# Altium schematic sheet dual-motor-driver.SchDoc
size A3
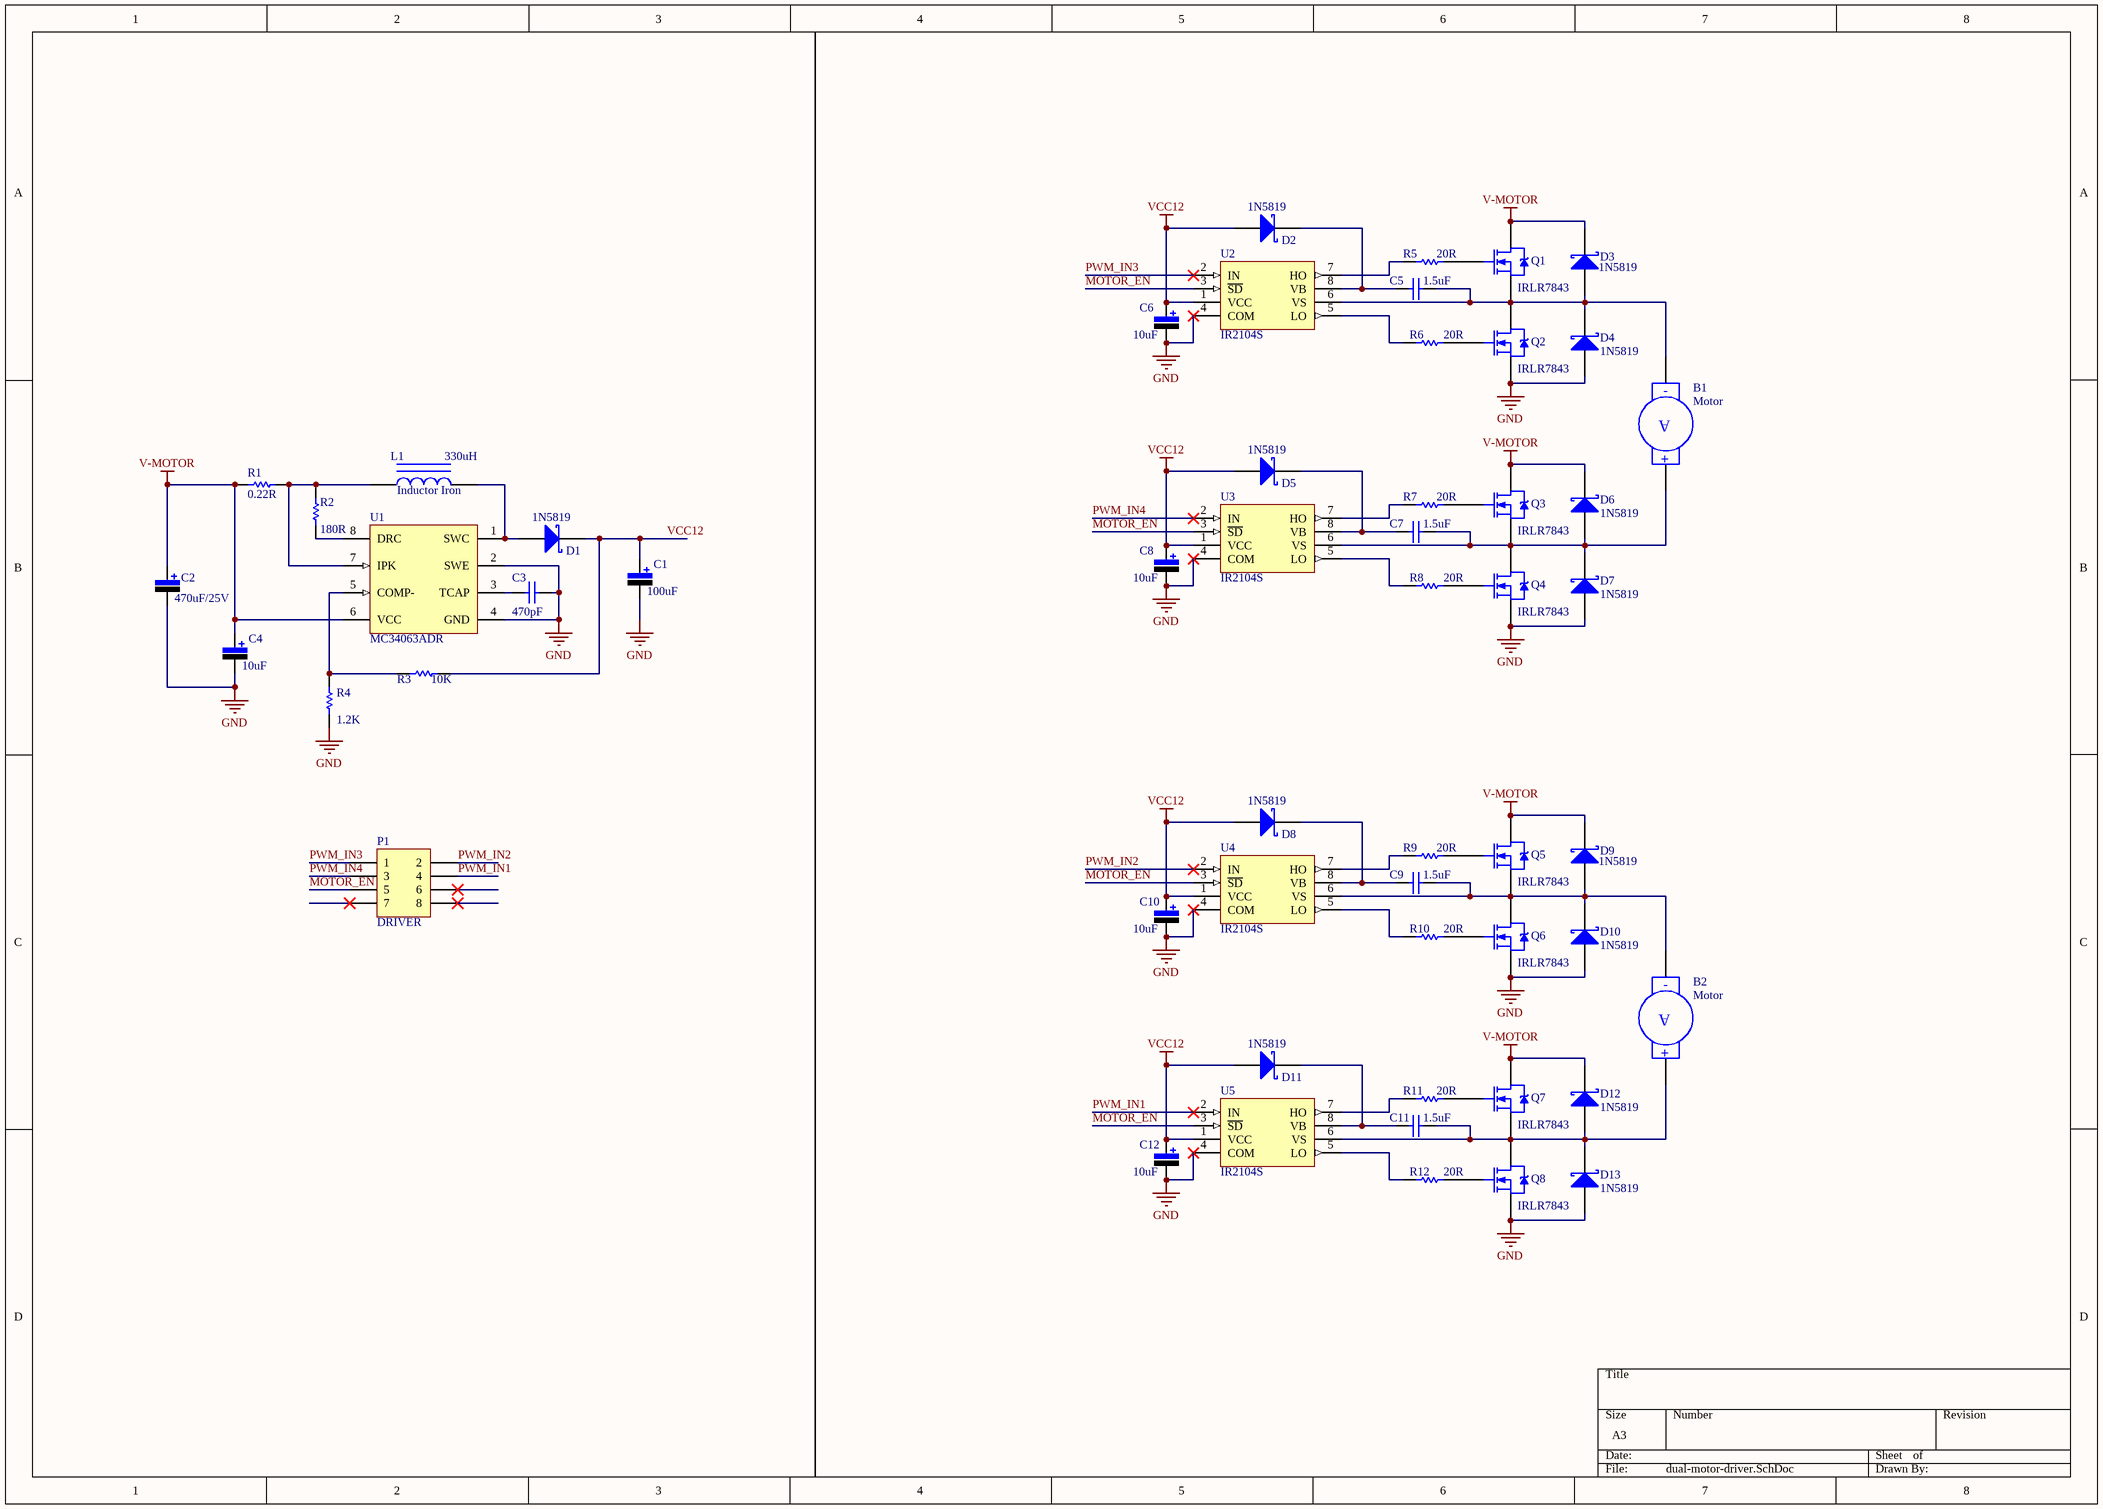
[diagram p0: dual-motor-driver.SchDoc]

## Parts
B1  Motor  [Con 2接线端子]
B2  Motor  [Con 2接线端子]
C1  value 100uF  [LC-CASE-D_7343]  (hidden comment: Cap-Pol)
C2  value 470uF/25V  [C-RB-3.5/8]  (hidden comment: Cap-Pol-ES)
C3  value 470pF  [LC-0603_C]  (hidden comment: Cap)
C4  value 10uF  [LC-CASE-C_6032]  (hidden comment: Cap-Pol)
C5  value 1.5uF  [LC-0805_C]  (hidden comment: Cap)
C6  value 10uF  [LC-CASE-C_6032]  (hidden comment: Cap-Pol)
C7  value 1.5uF  [LC-0805_C]  (hidden comment: Cap)
C8  value 10uF  [LC-CASE-C_6032]  (hidden comment: Cap-Pol)
C9  value 1.5uF  [LC-0805_C]  (hidden comment: Cap)
C10  value 10uF  [LC-CASE-C_6032]  (hidden comment: Cap-Pol)
C11  value 1.5uF  [LC-0805_C]  (hidden comment: Cap)
C12  value 10uF  [LC-CASE-C_6032]  (hidden comment: Cap-Pol)
D1  1N5819  [LC-SMA(DO-214AC)_S1]
D2  1N5819  [LC-SMA(DO-214AC)_S1]
D3  1N5819  [LC-SMA(DO-214AC)_S1]
D4  1N5819  [LC-SMA(DO-214AC)_S1]
D5  1N5819  [LC-SMA(DO-214AC)_S1]
D6  1N5819  [LC-SMA(DO-214AC)_S1]
D7  1N5819  [LC-SMA(DO-214AC)_S1]
D8  1N5819  [LC-SMA(DO-214AC)_S1]
D9  1N5819  [LC-SMA(DO-214AC)_S1]
D10  1N5819  [LC-SMA(DO-214AC)_S1]
D11  1N5819  [LC-SMA(DO-214AC)_S1]
D12  1N5819  [LC-SMA(DO-214AC)_S1]
D13  1N5819  [LC-SMA(DO-214AC)_S1]
L1  Inductor Iron  value 330uH  [L-SMD-12]
P1  DRIVER  [MHDR2X4]
Q1  IRLR7843  [TO-252AA_M]
Q2  IRLR7843  [TO-252AA_M]
Q3  IRLR7843  [TO-252AA_M]
Q4  IRLR7843  [TO-252AA_M]
Q5  IRLR7843  [TO-252AA_M]
Q6  IRLR7843  [TO-252AA_M]
Q7  IRLR7843  [TO-252AA_M]
Q8  IRLR7843  [TO-252AA_M]
R1  value 0.22R  [LC-0603_R]  (hidden comment: Res1)
R2  value 180R  [LC-0603_R]  (hidden comment: Res1)
R3  value 10K  [LC-0603_R]  (hidden comment: Res1)
R4  value 1.2K  [LC-0603_R]  (hidden comment: Res1)
R5  value 20R  [LC-0603_R]  (hidden comment: Res1)
R6  value 20R  [LC-0603_R]  (hidden comment: Res1)
R7  value 20R  [LC-0603_R]  (hidden comment: Res1)
R8  value 20R  [LC-0603_R]  (hidden comment: Res1)
R9  value 20R  [LC-0603_R]  (hidden comment: Res1)
R10  value 20R  [LC-0603_R]  (hidden comment: Res1)
R11  value 20R  [LC-0603_R]  (hidden comment: Res1)
R12  value 20R  [LC-0603_R]  (hidden comment: Res1)
U1  MC34063ADR  [LC-SOIC-8_150mil]
U2  IR2104S  [SO-8_N]
U3  IR2104S  [SO-8_N]
U4  IR2104S  [SO-8_N]
U5  IR2104S  [SO-8_N]

## Nets
GND: C1.2 C2.2 C3.1 C4.2 C6.2 C8.2 C10.2 C12.2 D4.1(A) D7.1(A) D10.1(A) D13.1(A) Q2.3(S) Q4.3(S) Q6.3(S) Q8.3(S) R4.1 U1.2(SWE) U1.4(GND) U2.4(COM) U3.4(COM) U4.4(COM) U5.4(COM)
V-MOTOR: C2.1 C4.1 D3.2(K) D6.2(K) D9.2(K) D12.2(K) Q1.4(D) Q3.4(D) Q5.4(D) Q7.4(D) R1.2 U1.6(VCC)
VCC12: C1.1 C6.1 C8.1 C10.1 C12.1 D1.2(K) D2.1(A) D5.1(A) D8.1(A) D11.1(A) R3.1 U2.1(VCC) U3.1(VCC) U4.1(VCC) U5.1(VCC)
MOTOR_EN: P1.5 U2.3(~{SD}) U3.3(~{SD}) U4.3(~{SD}) U5.3(~{SD})
PWM_IN1: P1.4 U5.2(IN)
PWM_IN2: P1.2 U4.2(IN)
PWM_IN3: P1.1 U2.2(IN)
PWM_IN4: P1.3 U3.2(IN)
NetB1_1: B1.1(+) C5.2 D3.1(A) D4.2(K) Q1.3(S) Q2.4(D) U2.6(VS)
NetB1_2: B1.2(-) C7.2 D6.1(A) D7.2(K) Q3.3(S) Q4.4(D) U3.6(VS)
NetB2_1: B2.1(+) C9.2 D9.1(A) D10.2(K) Q5.3(S) Q6.4(D) U4.6(VS)
NetB2_2: B2.2(-) C11.2 D12.1(A) D13.2(K) Q7.3(S) Q8.4(D) U5.6(VS)
NetC3_2: C3.2 U1.3(TCAP)
NetC5_1: C5.1 D2.2(K) U2.8(VB)
NetC7_1: C7.1 D5.2(K) U3.8(VB)
NetC9_1: C9.1 D8.2(K) U4.8(VB)
NetC11_1: C11.1 D11.2(K) U5.8(VB)
NetD1_1: D1.1(A) L1.2 U1.1(SWC)
NetL1_1: L1.1 R1.1 R2.2 U1.7(IPK)
NetQ1_1: Q1.1(G) R5.1
NetQ2_1: Q2.1(G) R6.1
NetQ3_1: Q3.1(G) R7.1
NetQ4_1: Q4.1(G) R8.1
NetQ5_1: Q5.1(G) R9.1
NetQ6_1: Q6.1(G) R10.1
NetQ7_1: Q7.1(G) R11.1
NetQ8_1: Q8.1(G) R12.1
NetR2_1: R2.1 U1.8(DRC)
NetR3_2: R3.2 R4.2 U1.5(COMP-)
NetR5_2: R5.2 U2.7(HO)
NetR6_2: R6.2 U2.5(LO)
NetR7_2: R7.2 U3.7(HO)
NetR8_2: R8.2 U3.5(LO)
NetR9_2: R9.2 U4.7(HO)
NetR10_2: R10.2 U4.5(LO)
NetR11_2: R11.2 U5.7(HO)
NetR12_2: R12.2 U5.5(LO)

Not connected (* = marked no-connect by the designer): P1 6* 7* 8*

## Notes on the sheet
- (in symbol Motor Servo) A

## Library data of the parts
B1 B2 = Motor Servo: Servo Motor; Published: 24-Mar-1999; LatestRevisionDate: 17-Jul-2002; LatestRevisionNote: Re-released for DXP Platform.; PackageReference: RAD-0.4; Publisher: Altium Limited; PackageDescription: Radial Cap, Thru-Hole; 2 Leads; 0.4 in Pin Spacing
C1 C4 C6 C8 C10 C12 = Cap-Pol-A: 钽电容; Published: 8-Jun-2000; LatestRevisionDate: 17-Jul-2002; LatestRevisionNote: Re-released for DXP Platform.; PackageReference: RB7.6-15; Publisher: Altium Limited
C2 = Cap-Pol-ES: 贴片铝电解电容; Published: 8-Jun-2000; LatestRevisionDate: 17-Jul-2002; LatestRevisionNote: Re-released for DXP Platform.; PackageReference: RB7.6-15; Publisher: Altium Limited
C3 C5 C7 C9 C11 = Cap: Capacitor; Published: 8-Jun-2000; LatestRevisionDate: 17-Jul-2002; LatestRevisionNote: Re-released for DXP Platform.; PackageReference: RAD-0.3; Publisher: Altium Limited; PackageDescription: Radial Cap, Thru-Hole; 2 Leads; 0.3 in Pin Spacing
D1-D13 = D Schottky: Schottky Diode; Published: 8-Jun-2000; LatestRevisionDate: 17-Jul-2002; LatestRevisionNote: Re-released for DXP Platform.; PackageReference: SMB; Publisher: Altium Limited; PackageDescription: DO-214-AA/SMB; 2 C-Bend Leads; Body 5.3 x 3.6 mm, inc. leads (LxW); Code_JEDEC: DO-214-AA
L1 = Inductor Iron: Magnetic-Core Inductor; Published: 24-Mar-1999; LatestRevisionDate: 17-Jul-2002; LatestRevisionNote: Re-released for DXP Platform.; PackageReference: AXIAL-0.9; Publisher: Altium Limited; PackageDescription: Axial Device, Thru-Hole; 2 Leads; 0.9 in Pin Spacing
P1 = Header 4X2: 电机驱动接口; LatestRevisionDate: 17-Jul-2002; LatestRevisionNote: Re-released for DXP Platform.; Publisher: Altium Limited
Q1-Q8 = IRLR8503: HEXFET Power MOSFET; Note: Pin 2 is trimmed and not drawn; Published: 17-Sep-2003; LatestRevisionDate: 20-Nov-2009; LatestRevisionNote: IPC-7351 Footprint Added.; DatasheetVersion: 21-Dec-2000; PackageVersion: Feb-2003; PackageReference: TO-252AA; Publisher: Altium Limited; PackageDescription: 3-Pin HEXFET Package 2.28 mm Pitch, 9.9 mm Lead Span; Code_JEDEC: TO-252-AA; ComponentLink1Description: Manufacturer Link; ComponentLink1URL: http://www.irf.com/; ComponentLink2Description: Datasheet; ComponentLink2URL: http://www.irf.com/product-info/datasheets/data/IRLR8503.pdf
R1-R12 = Res1: Resistor; Published: 8-Jun-2000; LatestRevisionDate: 17-Jul-2002; LatestRevisionNote: Re-released for DXP Platform.; PackageReference: AXIAL-0.3; Publisher: Altium Limited; PackageDescription: Axial Device, Thru-Hole; 2 Leads; 0.3 in Pin Spacing
U1 = MC34063ADR: Buck Inverting Buck-Boost Regulator with 3 to 40 V Input and 1.55 to 40 V Output, 0 to 70 degC, 8-Pin SOIC (D), Green (RoHS & no Sb/Br); Manufacturer: Texas Instruments; Duty Cycle(Max)(%): 90; Iout(Max)(A): 0.75; Iq(Typ)(mA): 4; Rating: Catalog; Regulated Outputs(#): 1; SubFamily: Step-Down Regulator; Switch Current Limit(Typ)(A): 1.5; Topology: Buck, Inverting Buck-Boost; Vin(Max)(V): 40; Vin(Min)(V): 3; Vout(Min)(V): 1.55; DatasheetVersion: SLLS636M; PackageVersion: revM, Jun-2011; PackageReference: D8; PackageDescription: 8-Pin Plastic Small Outline Integrated Circuit, 4.9 x 3.9 mm, Pitch 1.27 mm Pitch; Supplier 1: Digi-Key; Supplier Part Number 1: 296-17765-2-ND; Supplier 2: Digi-Key; Supplier Part Number 2: 296-17765-1-ND; Supplier 3: Digi-Key; Supplier Part Number 3: 296-17765-6-ND; Supplier 4: Farnell; Supplier Part Number 4: 1053581; Supplier 5: Newark; Supplier Part Number 5: 04K3499; Supplier 6: Mouser; Supplier Part Number 6: 595-MC34063ADR; Eco-Plan: Green (RoHS & no Sb/Br); Vout(Max)(V): 40; Mounting Technology: Surface Mount; Code_JEDEC: MS-012AA; PartNumber: MC34063ADR; ComponentLink1Description: Datasheet; ComponentLink1URL: http://www.ti.com/general/docs/lit/getliterature.tsp?genericPartNumber=MC34063A&fileType=pdf; ComponentLink2Description: Package Specification; ComponentLink2URL: http://www.ti.com/litv/pdf/msoi002j; ComponentLink3Description: URL Link1; ComponentLink3URL: Samples URL:http://www.ti.com/product/mc34063a#samples
U2-U5 = IR2104S: High and Low Side Driver; Published: 8-Jun-2000; LatestRevisionDate: 13-Apr-2006; LatestRevisionNote: IPC-7351 Footprint Added.; DatasheetVersion: PD600461; PackageVersion: Feb-2001; PackageReference: SO-8; Publisher: Altium Limited; PackageDescription: 8-Pin Plastic Small Outline Integrated Circuit 1.27 mm Pitch; Code_JEDEC: MS-012-AA; Code_IPC: SOIC127P600-8; ComponentLink1Description: Manufacturer Link; ComponentLink1URL: http://www.irf.com/; ComponentLink2Description: Datasheet; ComponentLink2URL: http://www.irf.com/product-info/datasheets/data/ir2104.pdf